# Altium schematic sheet Amp.SchDoc
size A; SheetNumber: 2; SheetTotal: 2; SPICEModelCacheOELODLHB: <root> / <DocumentId>OELODLHB</DocumentId> / <CacheFrame Number="0"> / <Model Name="bfu710f" Kind="CKT"> / <Text>.SUBCKT BFU710F 1 2 3 / Q1 11 22 33 33 Chip_710 Area=1 Region=1 Temp=25 Trise=0 Mode=1 Noise=yes M=1 / *package SOT343F / Rb2x	22 24	1.07413 / Rc2x	11 12	1.0494 / Lb2x	22 24	6.6493e-11 / Lc2x	11 12	6.67134e-11 / Cbe1	25 33	1.575795e-13 / Cbe2	22 23	6.4818e-014 / Cce1	13 33	1.3083644e-13 / Cce2	11 14	4.91284e-14 / Cbc1	25 28	3.101589e-15 / Cbc2	15 22	9.55071e-15 / Lb1	 2 25	2.82948e-10 / Lb2	24 25	7.31262e-10 / Lc1	 1 13	4.805e-15 / Lc2	12 13	3.84827e-10 / Le1	 3 33	7.94063e-11 / Rbc2	11 15	147.447 / Rbc1	13 28	855.844 / Rbe2	23 33	7.31739 / Rce2	14 33	8.25899 / .MODEL Chip_710 NPN / +	Is   = 59.79E-18 / +	Bf   = 275.1 / +	Nf   = 992.6e-3 / +	Vaf  = 10.34 / +	Ikf  = 24.45e-3 / +	Ise  = 24.75e-15 / +	Ne   = 2.024 / +	Br   = 81.44 / +	Nr   = 980.0e-3 / +	Var  = 4.245 / +	Ikr  = 3.620e-3 / +	Isc  = 100.0e-18 / +	Nc   = 1.578 / +	Rb   = 3.32 / +	Irb  = 12.17e-3 / +	Rbm  = 1.2 / +	Re   = 1.841 / +	Rc   = 50.31 / +	Cje  = 70.04e-15 / +	Vje  = 665.6e-3 / +	Mje  = 109.9e-3 / +	Cjc  = 21.67e-15 / +	Vjc  = 639.9e-3 / +	Mjc  = 267.9e-3 / +	Xcjc = 1.000 / +	Cjs  = 298.9e-15 / +	Vjs  = 360.9e-3 / +	Mjs  = 661.7e-3 / +	Fc   = 500.0e-3 / +	Xtf  = 43.92 / +	Tf   = 1.3236e-12 / +	Vtf  = -17.68 / +	Itf  = 89e-3 / +	Ptf  = 75.6 / +	Tr   = 1.7e-12 / +	Eg   = 1.110 / +	Xtb  = 0.000 / +	Xti  = 3.000 / .ENDS</Text> / </Model> / </CacheFrame> / </root>
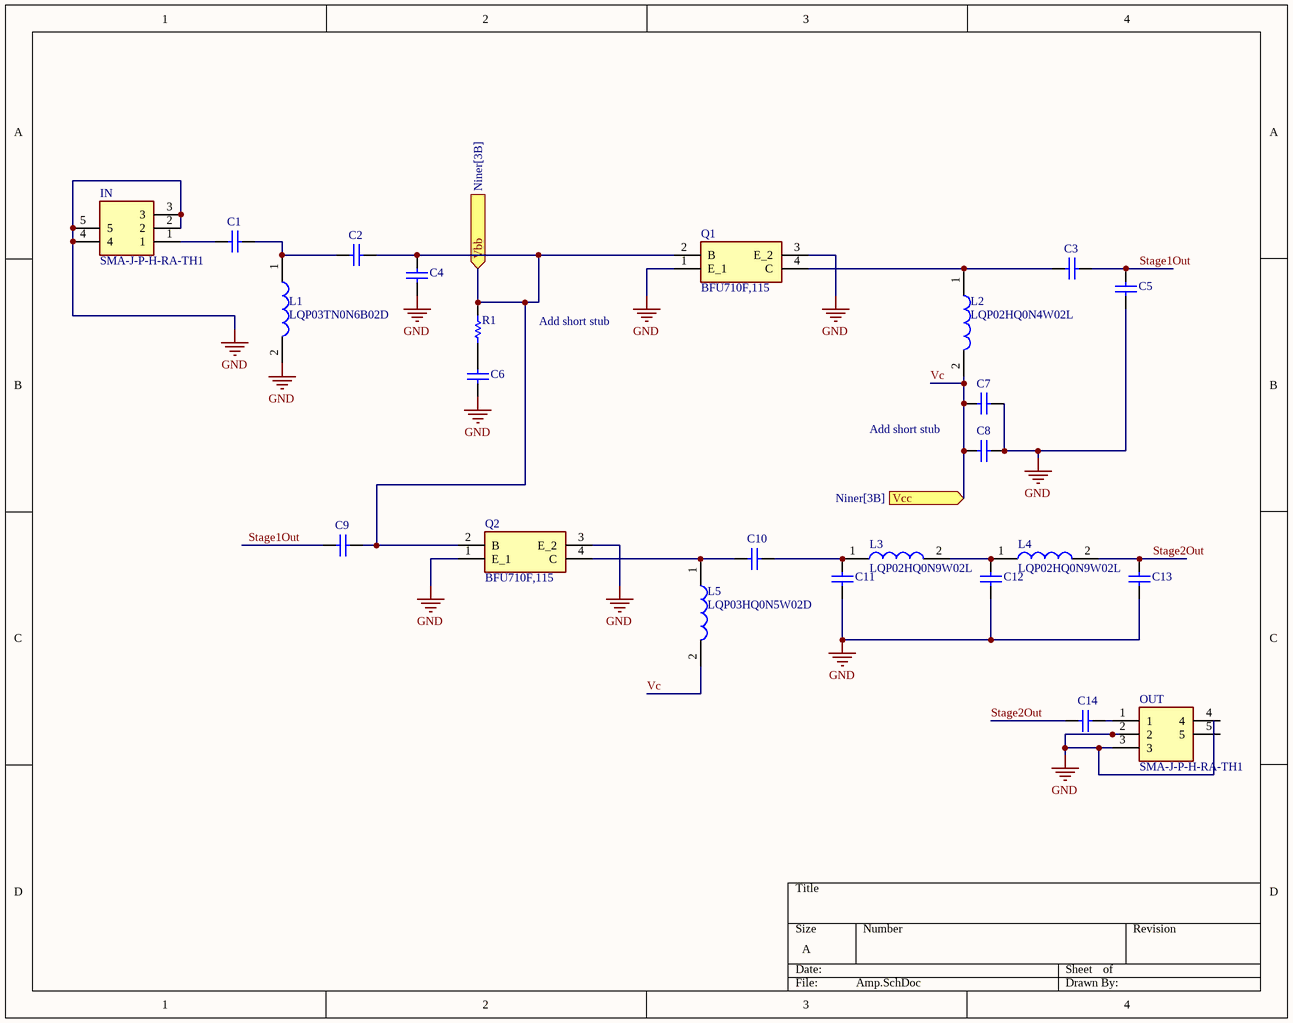
[diagram p0: Amp.SchDoc]

## Parts
C1  QSCF500Q0R7B1GV001T  [JT_0402]  (value not drawn)
C2  GQM1555C2DR60WB01D  [JT_0402]  (value not drawn)
C3  GQM1555C2DR40WB01  [JT_0402]  (value not drawn)
C4  GQM1555C2DR40WB01  [JT_0402]  (value not drawn)
C5  GQM1555C2DR40WB01  [JT_0402]  (value not drawn)
C6  GCQ0335C1HR60WB01D  [0402]  (value not drawn)
C7  GCQ0335C1HR60WB01D  [0402]  (value not drawn)
C8  GCQ0335C1HR60WB01D  [0402]  (value not drawn)
C9  QSCF500Q0R7B1GV001T  [JT_0402]  (value not drawn)
C10  GQM1555C2DR70WB01  [JT_0402]  (value not drawn)
C11  GQM1555C2DR40WB01  [JT_0402]  (value not drawn)
C12  GQM1555C2DR60WB01D  [JT_0402]  (value not drawn)
C13  GQM1555C2DR40WB01  [JT_0402]  (value not drawn)
C14  QSCF500Q0R7B1GV001T  [JT_0402]  (value not drawn)
IN  SMA-J-P-H-RA-TH1  [SMAJPHRATH1]
L1  LQP03TN0N6B02D  [LQP03TG3N1B02D]
L2  LQP02HQ0N4W02L  [LQP02HQ0N2B02E]
L3  LQP02HQ0N9W02L  [LQP02HQ0N2B02E]
L4  LQP02HQ0N9W02L  [LQP02HQ0N2B02E]
L5  LQP03HQ0N5W02D  [LQP03HQ0N5B02D]
OUT  SMA-J-P-H-RA-TH1  [SMAJPHRATH1]
Q1  BFU710F,115  [BFU710F115]
Q2  BFU710F,115  [BFU710F115]
R1  Resistor  [0402]  (value not drawn)

## Ports
Vbb (in, see Niner[3B]), Vcc (in, see Niner[3B])

## Nets
GND: C4.2 C5.1 C6.1 C7.1 C8.1 C11.1 C12.2 C13.1 IN.2 IN.3 IN.4 IN.5 L1.2 OUT.2 OUT.3 Q1.1(E_1) Q1.3(E_2) Q2.1(E_1) Q2.3(E_2)
Stage1Out: C3.2 C5.2 C9.2
Stage2Out: C13.2 C14.2 L4.2
Vbb: C2.1 C4.1 C9.1 Q1.2(B) Q2.2(B) R1.2 ; port Vbb
Vc: C7.2 C8.2 L2.2 L5.2 ; port Vcc
NetC1_1: C1.1 C2.2 L1.1
NetC1_2: C1.2 IN.1
NetC3_1: C3.1 L2.1 Q1.4(C)
NetC6_2: C6.2 R1.1
NetC10_1: C10.1 C11.2 L3.1
NetC10_2: C10.2 L5.1 Q2.4(C)
NetC12_1: C12.1 L3.2 L4.1
NetC14_1: C14.1 OUT.1

Not connected (* = marked no-connect by the designer): OUT 4 5

## Notes on the sheet
- Add short stub

## Library data of the parts
C1 C9 C10 C14 = Capacitor Ceramic: Value: 0.7p
C2 C12 = Capacitor Ceramic: Value: 0.6p
C3-C5 C11 C13 = Capacitor Ceramic: Value: 0.4pF
C6 C8 = Capacitor Ceramic: Value: 100pF
C7 = Capacitor Ceramic: Value: 1nF
IN OUT = SMA-J-P-H-RA-TH1: Connector; Manufacturer_Name: SAMTEC; Datasheet Link: http://suddendocs.samtec.com/prints/sma-j-p-x-ra-th1-mkt.pdf; Height: 9.86mm; Manufacturer_Part_Number: SMA-J-P-H-RA-TH1; Mouser Part Number: 200-SMAJPHRATH1; Mouser Price/Stock: https://www.mouser.co.uk/ProductDetail/Samtec/SMA-J-P-H-RA-TH1?qs=IAPfasySNH9bBmPI%2F132gw%3D%3D; Arrow Part Number: SMA-J-P-H-RA-TH1; Arrow Price/Stock: https://www.arrow.com/en/products/sma-j-p-h-ra-th1/samtec?region=europe
L1 = LQP03TN0N6B02D: Inductor; Manufacturer_Name: Murata Electronics; Value: 0.6nH; Datasheet Link: https://search.murata.co.jp/Ceramy/image/img/P02/JELF243C-0015.pdf; Height: 0.33mm; Manufacturer_Part_Number: LQP03TN0N6B02D; Mouser Part Number: 81-LQP03TN0N6B02D; Mouser Price/Stock: https://www.mouser.com/Search/Refine.aspx?Keyword=81-LQP03TN0N6B02D
L2 = LQP02HQ0N4W02L: Inductor; Manufacturer_Name: Murata Electronics; Datasheet Link: https://search.murata.co.jp/Ceramy/image/img/P02/JELF243C-0023.pdf; Height: 0.32mm; Manufacturer_Part_Number: LQP02HQ0N4W02L; Mouser Part Number: 81-LQP02HQ0N4W02L; Mouser Price/Stock: https://www.mouser.co.uk/ProductDetail/Murata-Electronics/LQP02HQ0N4W02L?qs=70cth9uAySen4TtaTnoOUg%3D%3D
L3 L4 = LQP02HQ0N9W02L: Inductor; Manufacturer_Name: Murata Electronics; Datasheet Link: https://search.murata.co.jp/Ceramy/image/img/P02/JELF243C-0023.pdf; Height: 0.32mm; Manufacturer_Part_Number: LQP02HQ0N9W02L; Mouser Part Number: 81-LQP02HQ0N9W02L; Mouser Price/Stock: https://www.mouser.co.uk/ProductDetail/Murata-Electronics/LQP02HQ0N9W02L?qs=70cth9uAySf%252Bytje7ApwGQ%3D%3D
L5 = LQP03HQ0N5W02D: Inductor; Manufacturer_Name: Murata Electronics; Datasheet Link: https://search.murata.co.jp/Ceramy/image/img/P02/JELF243C-0021.pdf; Height: 0.42mm; Manufacturer_Part_Number: LQP03HQ0N5W02D; Mouser Part Number: 81-LQP03HQ0N5W02D; Mouser Price/Stock: https://www.mouser.co.uk/ProductDetail/Murata-Electronics/LQP03HQ0N5W02D?qs=xZ%2FP%252Ba9zWqaDUf%2FupWIkIQ%3D%3D
Q1 Q2 = BFU710F,115: Transistor BJT NPN; Manufacturer_Name: NXP; Datasheet Link: http://www.nxp.com/docs/en/data-sheet/BFU710F.pdf; Height: 0.75mm; Manufacturer_Part_Number: BFU710F,115; Mouser Part Number: 771-BFU710F115; Mouser Price/Stock: https://www.mouser.com/Search/Refine.aspx?Keyword=771-BFU710F115
R1 = Resistor: Resistive element; Value: 10